# Altium schematic sheet v1.0.SchDoc
size 88 x 55 mm
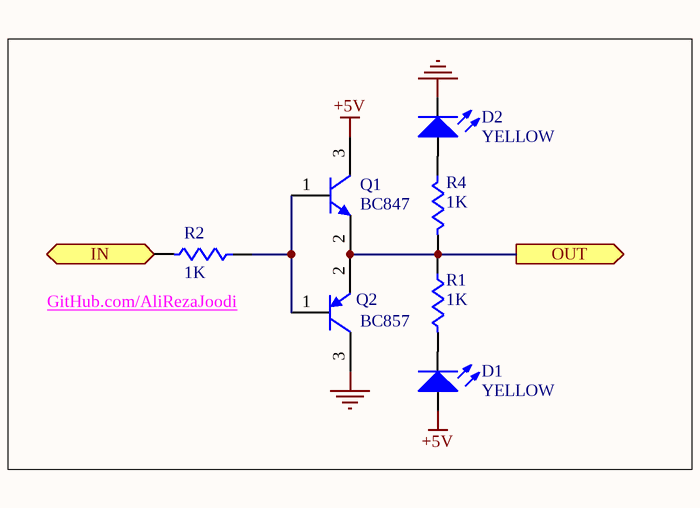
[diagram p0: v1.0.SchDoc]

## Parts
D1  YELLOW  [0805_Diode]
D2  YELLOW  [0805_Diode]
Q1  BC847  [SOT23-3N]
Q2  BC857  [SOT23-3N]
R1  1K  [0805]
R2  1K  [0805]
R4  1K  [0805]

## Ports
IN (in), OUT (out)

## Nets
+5V: D1.1(A) Q1.3(C)
GND: D2.2(K) Q2.3(C)
IN: R2.2 ; port IN
OUT: Q1.2(E) Q2.2(E) R1.1 R4.2 ; port OUT
NetD1_2: D1.2(K) R1.2
NetD2_1: D2.1(A) R4.1
NetQ1_1: Q1.1(B) Q2.1(B) R2.1

## Notes on the sheet
- (near R2) GitHub.com/AliRezaJoodi

## Library data of the parts
D1 D2 = Optical Transmitter: Typical INFRARED GaAs LED; Manufacturer: Generic Components; Class I: Optoelectronic; Published: 8-Jun-2000; Revision: July-2002: Re-released for DXP Platform.; Publisher: Altium Limited; Class II: LED
Q1 = BC847: Silicon Bipolar Transistor
Q2 = BC857: Silicon Bipolar Transistor
R1 R2 R4 = Res1: Resistor; Manufacturer: Generic Components; Class I: Passive; Published: 8-Jun-2000; Revision: July-2002: Re-released for DXP Platform.; Publisher: Altium Limited; Class II: Resistor